# Altium schematic sheet Sheet1.SchDoc
size A; SheetNumber: 1; SheetTotal: 1
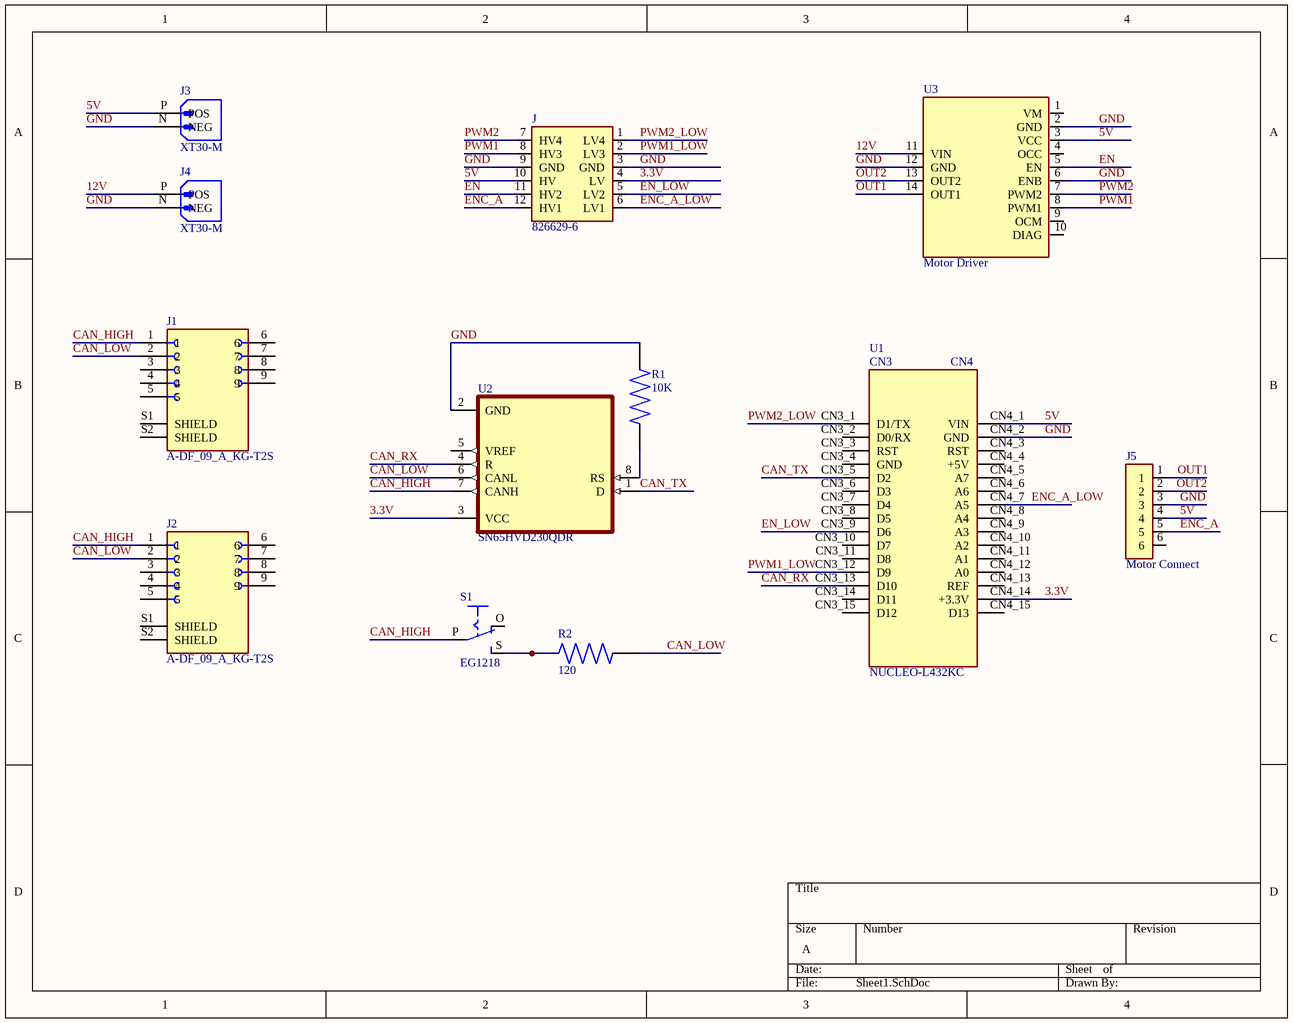
[diagram p0: Sheet1.SchDoc]

## Parts
J  826629-6  [HDRV6W63P254_6X1_1524X250X950]
J1  A-DF_09_A_KG-T2S  [ASSMANN_A-DF_09_A_KG-T2S]
J2  A-DF_09_A_KG-T2S  [ASSMANN_A-DF_09_A_KG-T2S]
J3  XT30-M  [AMASS_XT60-M]
J4  XT30-M  [AMASS_XT60-M]
J5  Motor Connect  [HDRV6W63P254_6X1_1524X250X950]
R1  10K  [RESC3216X65N]
R2  120  [RESC3216X65N]
S1  EG1218  [EG1218]
U1  NUCLEO-L432KC  [MODULE_NUCLEO-L432KC]
U2  SN65HVD230QDR  [SOIC127P599X175-8N]
U3  Motor Driver  [TE_826629-8]

## Nets
3.3V: J.4(LV) U1.CN4_14(+3.3V) U2.3(VCC)
5V: J.10(HV) J3.P(POS) J5.4 U1.CN4_1(VIN) U3.3(VCC)
12V: J4.P(POS) U3.11(VIN)
CAN_HIGH: J1.1 J2.1 S1.P U2.7(CANH)
CAN_LOW: J1.2 J2.2 R2.1 U2.6(CANL)
CAN_RX: U1.CN3_13(D10) U2.4(R)
CAN_TX: U1.CN3_5(D2) U2.1(D)
EN: J.11(HV2) U3.5(EN)
EN_LOW: J.5(LV2) U1.CN3_9(D6)
ENC_A: J.12(HV1) J5.5
ENC_A_LOW: J.6(LV1) U1.CN4_7(A5)
GND: J.3(GND) J.9(GND) J3.N(NEG) J4.N(NEG) J5.3 R1.2 U1.CN4_2(GND) U2.2(GND) U3.2(GND) U3.6(ENB) U3.12(GND)
OUT1: J5.1 U3.14(OUT1)
OUT2: J5.2 U3.13(OUT2)
PWM1: J.8(HV3) U3.8(PWM1)
PWM1_LOW: J.2(LV3) U1.CN3_12(D9)
PWM2: J.7(HV4) U3.7(PWM2)
PWM2_LOW: J.1(LV4) U1.CN3_1(D1/TX)
NetR1_1: R1.1 U2.8(RS)
NetR2_2: R2.2 S1.S

Not connected (* = marked no-connect by the designer): J1 3 4 5 6 7 8 9 S1(SHIELD) S2(SHIELD); J2 3 4 5 6 7 8 9 S1(SHIELD) S2(SHIELD); J5 6; S1 O; U1 CN3_2(D0/RX) CN3_3(RST) CN3_4(GND) CN3_6(D3) CN3_7(D4) CN3_8(D5) CN3_10(D7) CN3_11(D8) CN3_14(D11) CN3_15(D12) CN4_3(RST) CN4_4(+5V) CN4_5(A7) CN4_6(A6) CN4_8(A4) CN4_9(A3) CN4_10(A2) CN4_11(A1) CN4_12(A0) CN4_13(REF) CN4_15(D13); U2 5(VREF); U3 1(VM) 4(OCC) 9(OCM) 10(DIAG)

## Notes on the sheet
- (in symbol NUCLEO-L432KC) CN3; CN4

## Library data of the parts
J J5 = 826629-6: Conn Unshrouded Header HDR 6 POS 2.54mm Solder ST Thru-Hole Automotive Carton; MF: TE Connectivity; MP: 826629-6; DigiKey-Purchase-URL: https://snapeda.com/shop?store=DigiKey&id=281644; Package: None; EU_RoHS_Compliance: Compliant; Price: None; Arrow_Electronics-Purchase-URL: https://snapeda.com/shop?store=Arrow+Electronics&id=281644; Value: *; Mouser-Purchase-URL: https://snapeda.com/shop?store=Mouser&id=281644; SnapEDA_Link: https://www.snapeda.com/parts/826629-6/TE%20Connectivity%20AMP%20Connectors/view-part/281644/?ref=snap; Availability: Unavailable
J1 J2 = A-DF_09_A_KG-T2S: 9 Position D-Sub Receptacle, Female Sockets Connector; MF: Assmann WSW; MP: A-DF 09 A/KG-T2S; Value: *; Purchase-URL: https://pricing.snapeda.com/search/part/A-DF 09 A/KG-T2S/?ref=eda; Package: None; Check_prices: https://www.snapeda.com/parts/A-DF%2009%20A/KG-T2S/Assmann+WSW+Components/view-part/?ref=eda; Price: None; SnapEDA_Link: https://www.snapeda.com/parts/A-DF%2009%20A/KG-T2S/Assmann+WSW+Components/view-part/?ref=snap; Availability: In Stock
J3 J4 = XT30-M: Plug; DC supply; XT60; male; PIN: 2; for cable; soldered; 30A; 500V; MP: XT60-M; MF: AMASS; Package: Package; Availability: Not in stock; SnapEDA_Link: https://www.snapeda.com/parts/XT60-M/AMASS/view-part/?ref=snap; Check_prices: https://www.snapeda.com/parts/XT60-M/AMASS/view-part/?ref=eda; Price: None; Value: *
R1 R2 = KTR18EZPF9530: Package: None; Price: None; Value: *; MP: KTR18EZPF9530; Availability: Unavailable
S1 = EG1218: <b>SLIDING SWITCH</b><p> 0.1" spacing through hole, vertical SPDT slide switch <p>http://www.ladyada.net/library/pcb/eaglelibrary.html</p>; Package: None; Availability: Unavailable; Value: *; MP: EG1218; Price: None
U1 = NUCLEO-L432KC: STM32 Nucleo-32 development board with STM32L432KC MCU, supports Arduino connectivity; Package: None; Price: None; Availability: Unavailable; MP: NUCLEO-L432KC; Value: *
U2 = SN65HVD230QDR: 3.3-V CAN Transceiver with Standby Mode 8-SOIC -40 to 125; MF: Texas Instruments; Package: SOIC-8 Texas Instruments; Price: None; MP: SN65HVD230QDR; Availability: Good; Value: *; Check_prices: https://www.snapeda.com/parts/SN65HVD230QDR/Texas%20Instruments/view-part/1178075/?ref=eda; Purchase-URL: https://pricing.snapeda.com/search/part/SN65HVD230QDR/?ref=eda; SnapEDA_Link: https://www.snapeda.com/parts/SN65HVD230QDR/Texas%20Instruments/view-part/1178075/?ref=snap
U3 = 826629-8: Conn Unshrouded Header HDR 8 POS 2.54mm Solder ST Thru-Hole Automotive Box; MF: TE Connectivity; EU_RoHS_Compliance: Compliant; TE_purchase_URL: https://www.te.com/usa-en/product-826629-8.html?te_bu=Cor&te_type=disp&te_campaign=seda_glo_cor-seda-global-disp-prtnr-fy19-seda-model-bom-cta_sma-317_1&elqCampaignId=32493; MP: 826629-8; Value: *; Availability: Unavailable; SnapEDA_Link: https://www.snapeda.com/parts/826629-8/TE%20Connectivity%20AMP%20Connectors/view-part/456641/?ref=snap; Price: None; Package: None